# Altium schematic sheet boxer_RS485.SchDoc: RS485
size A4; DrawnBy: Damian Dolewski; Engineer: Damian Dolewski; DocumentNumber: 3; SheetNumber: 3; SheetTotal: 3
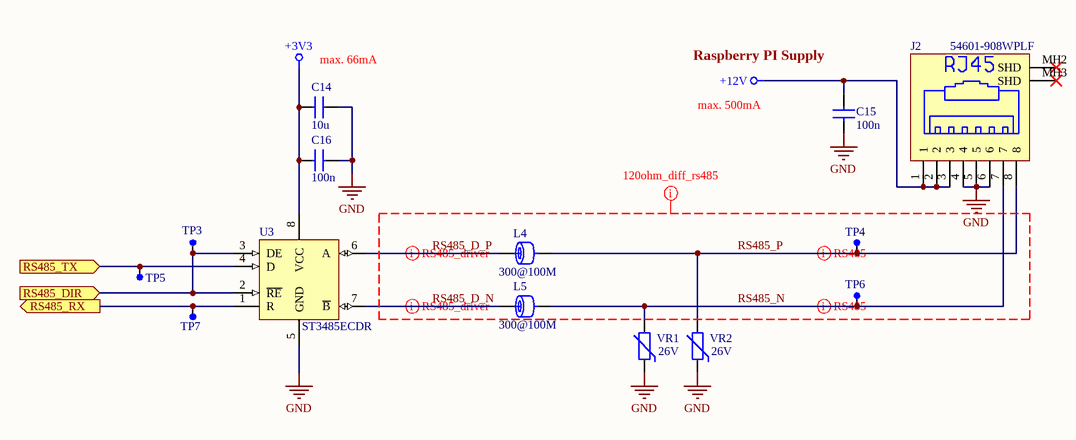
[diagram p0: boxer_RS485.SchDoc]

## Parts
C14  value 10u  [C_1206]  (hidden comment: TME: CL31A226MOCLNNC)
C15  value 100n  [C_0805]  (hidden comment: Capacitor)
C16  value 100n  [C_0805]  (hidden comment: Capacitor)
J2  54601-908WPLF  [RJ45_54601-908WPLF]
L4  value 300@100M  [L_0805]  (hidden comment: 742792031)
L5  value 300@100M  [L_0805]  (hidden comment: 742792031)
TP3  TEST PAD  [PIN]  (value not drawn)
TP4  TEST PAD  [PIN]  (value not drawn)
TP5  TEST PAD  [PIN]  (value not drawn)
TP6  TEST PAD  [PIN]  (value not drawn)
TP7  TEST PAD  [PIN]  (value not drawn)
U3  ST3485ECDR  [SO8]
VR1  value 26V  [VR_0805]  (hidden comment: AMCV-0805-260-C800N-T)
VR2  value 26V  [VR_0805]  (hidden comment: AMCV-0805-260-C800N-T)

## Ports
RS485_DIR (in), RS485_RX (out), RS485_TX (in)

## Nets
+3V3: C14.2 C16.1 U3.8(VCC)
+12V: C15.1 J2.1 J2.2 J2.3
GND: C14.1 C15.2 C16.2 J2.4 J2.5 J2.6 U3.5(GND) VR1.2 VR2.2
RS485_D_N: L5.1 U3.7(~{B})
RS485_D_P: L4.1 U3.6(A)
RS485_DIR: TP3.1 U3.2(~{RE}) U3.3(DE) ; port RS485_DIR
RS485_N: J2.7 L5.2 TP6.1 VR1.1
RS485_P: J2.8 L4.2 TP4.1 VR2.1
RS485_RX: TP7.1 U3.1(R) ; port RS485_RX
RS485_TX: TP5.1 U3.4(D) ; port RS485_TX

Not connected (* = marked no-connect by the designer): J2 MH2(SHD)* MH3(SHD)*

## Layout directives
differential pair: RS485_D_N, RS485_D_P, RS485_N, RS485_P
net class 120ohm_diff_rs485; rule Impedance Constraint [Min = 115.0    Max = 125.0    ]: RS485_D_N, RS485_D_P, RS485_N, RS485_P

## Notes on the sheet
- (near C14) max. 66mA
- (near C15) Raspberry PI Supply
- max. 500mA
- Title:
- Size:
- A4
- Number:
- Revision:
- Date:
- File:
- Sheet
- of

## Library data of the parts
C14 = Capacitor
J2 = RJ45-8: RJ45 Socket, 8pin, No Key, Molex MX-95001-2881; Value: 54601-908WPLF
L4 L5 = FB: Ferrite Bead
TP3-TP7 = TEST_PAD: PAD 1.5mm
U3 = ST485BDR: RS-422/RS-485 Interface IC Hi-Spd Lo Pwr Trans; ComponentLink1Description: Manufacturer Link; ComponentLink1URL: http://www.ti.com/; ComponentLink2Description: Datasheet; ComponentLink2URL: http://www-s.ti.com/sc/ds/sn75176b.pdf; Value: ST3485ECDR
VR1 VR2 = Varistor: 34.5V 20A Varistor 1 Circuit Surface Mount, MLCV 0805 (2012 Metric)